# Altium schematic sheet Mecanique.SchDoc
size A4
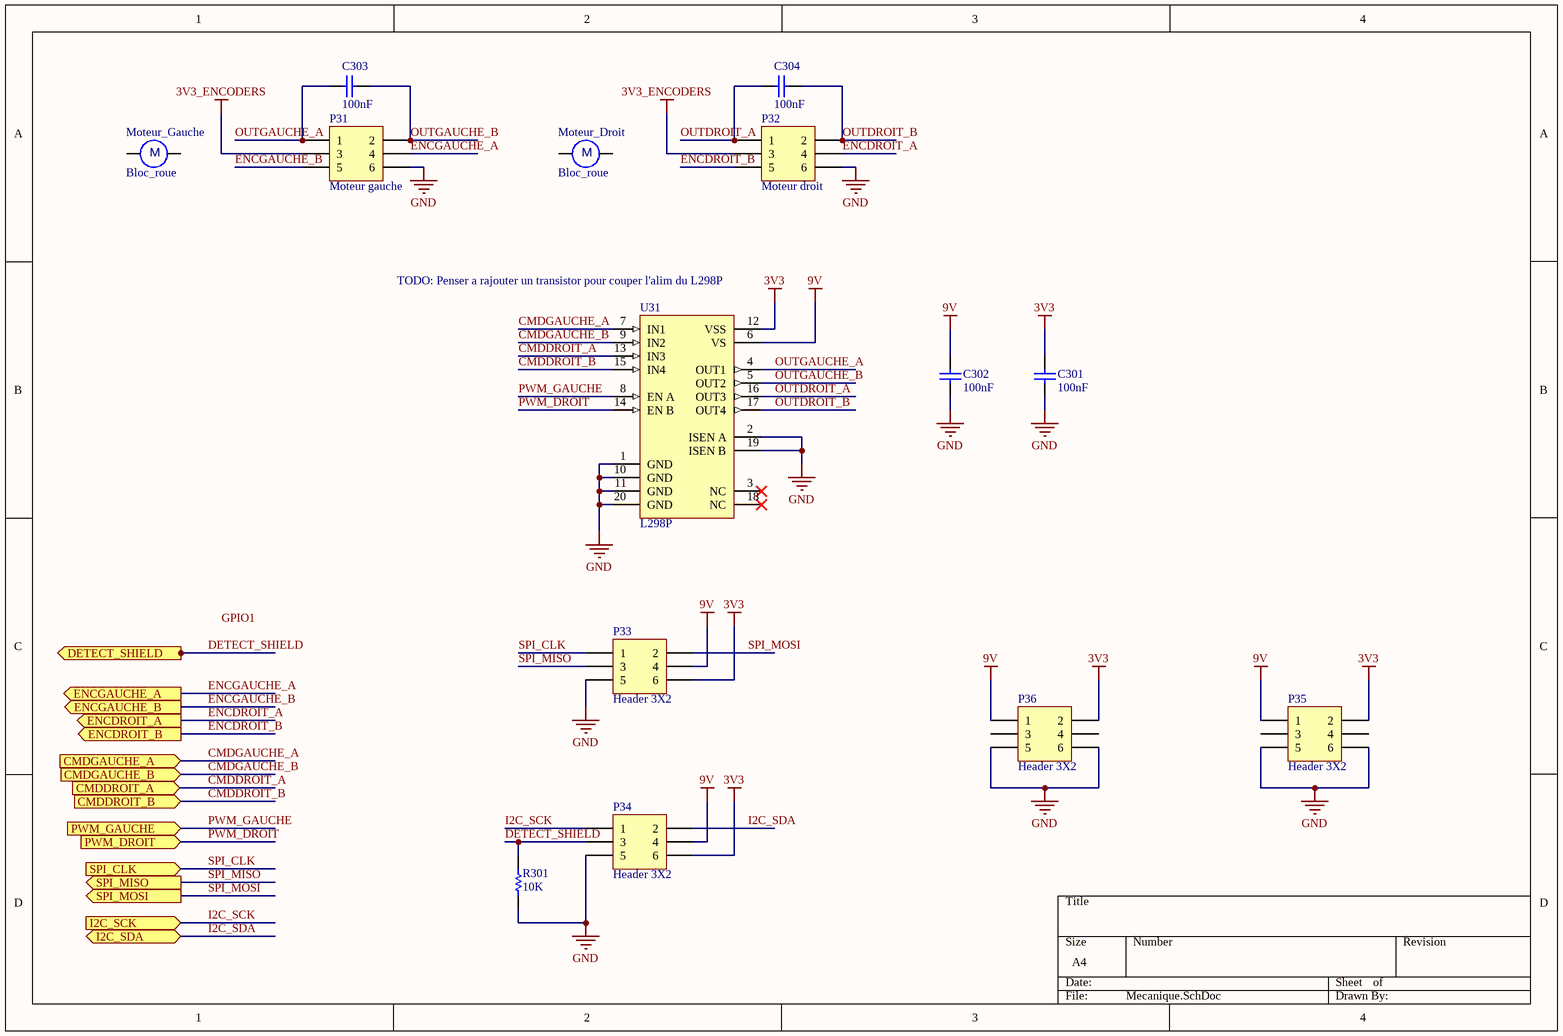
[diagram p0: Mecanique.SchDoc]

## Parts
C301  value 100nF  [CAPC1206(3216)170_L]  (hidden comment: CAP 100nF)
C302  value 100nF  [CAPC1206(3216)170_L]  (hidden comment: CAP 100nF)
C303  value 100nF  [CAPC1206(3216)170_L]  (hidden comment: CAP 100nF)
C304  value 100nF  [CAPC1206(3216)170_L]  (hidden comment: CAP 100nF)
Moteur_Droit  Bloc_roue  [Bloc roue]
Moteur_Gauche  Bloc_roue  [Bloc roue]
P31  Moteur gauche  [HDR2X3]
P32  Moteur droit  [HDR2X3]
P33  Header 3X2  [HDR2X3]
P34  Header 3X2  [HDR2X3]
P35  Header 3X2  [HDR2X3]
P36  Header 3X2  [HDR2X3]
R301  10K  [RESC1206(3216)_M]
U31  L298P  [PowerSO20_N]

## Ports
CMDDROIT_A (in), CMDDROIT_B (in), CMDGAUCHE_A (in), CMDGAUCHE_B (in), DETECT_SHIELD (out), ENCDROIT_A (out), ENCDROIT_B (out), ENCGAUCHE_A (out), ENCGAUCHE_B (out), I2C_SCK (in), I2C_SDA (bidir), PWM_DROIT (in), PWM_GAUCHE (in), SPI_CLK (in), SPI_MISO (out), SPI_MOSI (out)

## Nets
3V3: C301.1 P33.6 P34.6 P35.2 P36.2 U31.12(VSS)
3V3_ENCODERS: P31.3 P32.3
9V: C302.1 P33.4 P34.4 P35.1 P36.1 U31.6(VS)
GND: C301.2 C302.2 P31.6 P32.6 P33.5 P34.5 P35.5 P35.6 P36.5 P36.6 R301.2 U31.1(GND) U31.2(ISEN_A) U31.10(GND) U31.11(GND) U31.19(ISEN_B) U31.20(GND)
CMDDROIT_A: U31.13(IN3) ; port CMDDROIT_A
CMDDROIT_B: U31.15(IN4) ; port CMDDROIT_B
CMDGAUCHE_A: U31.7(IN1) ; port CMDGAUCHE_A
CMDGAUCHE_B: U31.9(IN2) ; port CMDGAUCHE_B
DETECT_SHIELD: P34.3 R301.1 ; port DETECT_SHIELD
ENCDROIT_A: P32.4 ; port ENCDROIT_A
ENCDROIT_B: P32.5 ; port ENCDROIT_B
ENCGAUCHE_A: P31.4 ; port ENCGAUCHE_A
ENCGAUCHE_B: P31.5 ; port ENCGAUCHE_B
I2C_SCK: P34.1 ; port I2C_SCK
I2C_SDA: P34.2 ; port I2C_SDA
OUTDROIT_A: C304.2 P32.1 U31.16(OUT3)
OUTDROIT_B: C304.1 P32.2 U31.17(OUT4)
OUTGAUCHE_A: C303.2 P31.1 U31.4(OUT1)
OUTGAUCHE_B: C303.1 P31.2 U31.5(OUT2)
PWM_DROIT: U31.14(EN_B) ; port PWM_DROIT
PWM_GAUCHE: U31.8(EN_A) ; port PWM_GAUCHE
SPI_CLK: P33.1 ; port SPI_CLK
SPI_MISO: P33.3 ; port SPI_MISO
SPI_MOSI: P33.2 ; port SPI_MOSI

Not connected (* = marked no-connect by the designer): P35 3 4; P36 3 4; U31 3(NC)* 18(NC)*

## Notes on the sheet
- (near U31) TODO: Penser a rajouter un transistor pour couper l'alim du L298P
- Labels drawn without touching a wire or pin: GPIO1
- (in symbol Bloc_roue) M

## Library data of the parts
C301-C304 = CMP-1037-04201-1: CAP 100nF 50V ±10% 1206 (3216 Metric) Thickness 1.7mm SMD; Case-Metric: 3216; Tolerance: Â±10%; Case-EIA: 1206; Max Thickness: 1.7 mm; Rated Voltage: 50 V; Technology: SMT
P31-P36 = Header 3X2: Header, 3-Pin, Dual row; LatestRevisionDate: 17-Jul-2002; LatestRevisionNote: Re-released for DXP Platform.; Publisher: Altium Limited; Distributeur: Farnell : 1022231
R301 = CMP-1014-00098-1: 10K 0.25W 5% 1206 (3216 Metric)  SMD; Case-Metric: 3216; Case-EIA: 1206; Power: 0.25 W; Tolerance: 5 %; Value: 10K; Technology: SMT
U31 = L298P: Dual Full Bridge Driver; Published: 8-Jun-2000; LatestRevisionDate: 13-Apr-2006; LatestRevisionNote: IPC-7351 Footprint Added.; DatasheetVersion: Jul-1999; PackageVersion: May-1998; PackageReference: POWERSO20; Publisher: Altium Limited; PackageDescription: 20-Pin Small Outline Package 1.27 mm Pitch; Code_JEDEC: MO-166; ComponentLink1Description: Manufacturer Link; ComponentLink1URL: http://www.st.com/; ComponentLink2Description: Datasheet; ComponentLink2URL: http://www.st.com/stonline/products/literature/ds/1773/l298.pdf; Distributeur: Radiospares : 880-5308